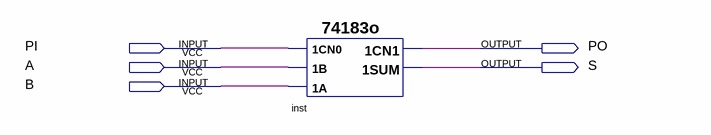
[diagram p0: schematic sheet]
// Quartus schematic Mark13.bdf as structural Verilog: 1 symbols, 5 pins
module Mark13 (
  input  PI,
  input  A,
  input  B,
  output PO,
  output S
);

  \74183o  inst (.\1CN0 (PI), .\1A (B), .\1B (A), .\1CN1 (PO), .\1SUM (S));
endmodule
